# Altium schematic sheet MOTOR.SchDoc
size A3
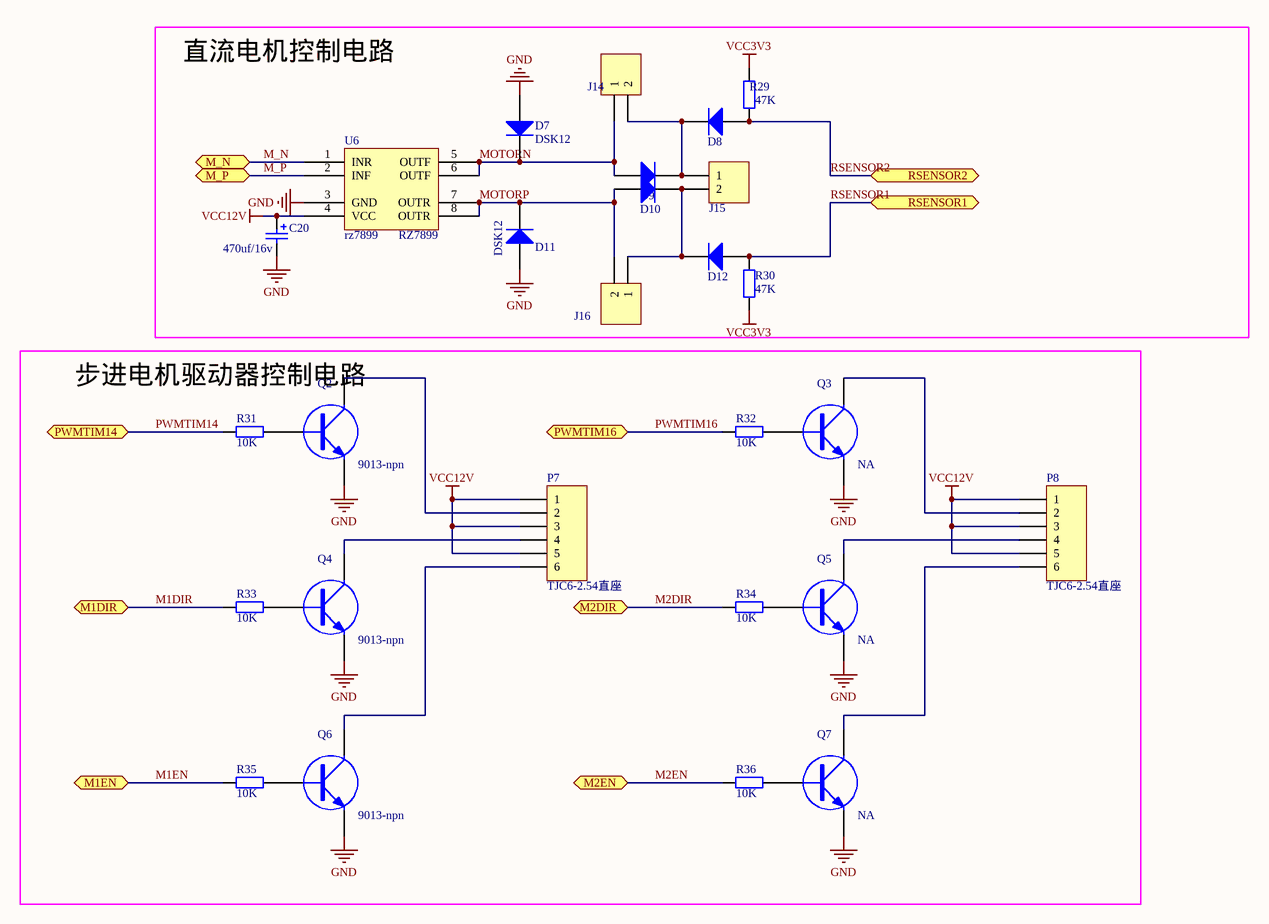
[diagram p0: MOTOR.SchDoc]

## Parts
C20  470uf/16v  [cap_470/16v]
D7  型号: DSK12  [SOD123_D]  (hidden comment: Diode_SOD523)
D8  Diode_SOD323  [SOD323_D]  (value not drawn)
D9  Diode_DO214AB  [SOD123-F]  (value not drawn)
D10  Diode_DO214AB  [SOD123-F]  (value not drawn)
D11  型号: DSK12  [SOD123_D]  (hidden comment: Diode_SOD523)
D12  Diode_SOD323  [SOD323_D]  (value not drawn)
J14  XHB2.54-2PIN-带锁扣  [SIP2]  (value not drawn)
J15  XHB2.54-2PIN-带锁扣  [SIP2]  (value not drawn)
J16  XHB2.54-2PIN-带锁扣  [SIP2]  (value not drawn)
P7  TJC6-2.54直座  [SIP6]
P8  TJC6-2.54直座  [SIP6]
Q2  型号: 9013-npn  [SOT23]  (hidden comment: NPN_SOT23)
Q3  型号: NA  [SOT23]  (hidden comment: NPN_SOT23)
Q4  型号: 9013-npn  [SOT23]  (hidden comment: NPN_SOT23)
Q5  型号: NA  [SOT23]  (hidden comment: NPN_SOT23)
Q6  型号: 9013-npn  [SOT23]  (hidden comment: NPN_SOT23)
Q7  型号: NA  [SOT23]  (hidden comment: NPN_SOT23)
R29  型号: 47K  [0603R]  (hidden comment: Res_0603)
R30  型号: 47K  [0603R]  (hidden comment: Res_0603)
R31  型号: 10K  [0603R]  (hidden comment: Res_0603)
R32  型号: 10K  [0603R]  (hidden comment: Res_0603)
R33  型号: 10K  [0603R]  (hidden comment: Res_0603)
R34  型号: 10K  [0603R]  (hidden comment: Res_0603)
R35  型号: 10K  [0603R]  (hidden comment: Res_0603)
R36  型号: 10K  [0603R]  (hidden comment: Res_0603)
U6  rz7899  [SOP_8]

## Blocks framed on the sheet
直流电机控制电路: C20 D7-D12 J14-J16 R29 R30 U6
步进电机驱动器控制电路: P7 P8 Q2-Q7 R31-R36

## Ports
M1DIR, M1EN, M2DIR, M2EN, M_N, M_P, PWMTIM14, PWMTIM16, RSENSOR1, RSENSOR2

## Nets
GND: C20.2 D7.1 D11.1 Q2.2(E) Q3.2(E) Q4.2(E) Q5.2(E) Q6.2(E) Q7.2(E) U6.3(GND)
VCC3V3: R29.2 R30.1
VCC12V: C20.1 P7.1 P7.3 P7.5 P8.1 P8.3 P8.5 U6.4(VCC)
M1DIR: R33.1 ; port M1DIR
M1EN: R35.1 ; port M1EN
M2DIR: R34.1 ; port M2DIR
M2EN: R36.1 ; port M2EN
M_N: U6.1(INR) ; port M_N
M_P: U6.2(INF) ; port M_P
MOTORN: D7.2 D9.1 J14.1 U6.5(OUTF) U6.6(OUTF)
MOTORP: D10.1 D11.2 J16.2 U6.7(OUTR) U6.8(OUTR)
PWMTIM14: R31.1 ; port PWMTIM14
PWMTIM16: R32.1 ; port PWMTIM16
RSENSOR1: D12.1 R30.2 ; port RSENSOR1
RSENSOR2: D8.1 R29.1 ; port RSENSOR2
NetD8_2: D8.2 D9.2 J14.2 J15.1
NetD10_2: D10.2 D12.2 J15.2 J16.1
NetP7_2: P7.2 Q2.3(C)
NetP7_4: P7.4 Q4.3(C)
NetP7_6: P7.6 Q6.3(C)
NetP8_2: P8.2 Q3.3(C)
NetP8_4: P8.4 Q5.3(C)
NetP8_6: P8.6 Q7.3(C)
NetQ2_1: Q2.1(B) R31.2
NetQ3_1: Q3.1(B) R32.2
NetQ4_1: Q4.1(B) R33.2
NetQ5_1: Q5.1(B) R34.2
NetQ6_1: Q6.1(B) R35.2
NetQ7_1: Q7.1(B) R36.2

## Library data of the parts
C20 = Cap_直插470uf/16v: Polarized Capacitor (Radial); 名称: 贴片电容; 容差: 20%; 型号: 470UF/16V电容; 参考网址: *
D7 D11 = Diode_SOD523: Default Diode; 名称: 贴片二极管; 容差: *
D8 D12 = Diode_SOD323: Default Diode; Published: 8-Jun-2000; LatestRevisionDate: 17-Jul-2002; LatestRevisionNote: Re-released for DXP Platform.; PackageVersion: Sep-1996; PackageReference: SMC; Publisher: Altium Limited; PackageDescription: DO-214-AB/SMC; 2 C-Bend Leads; Body 7.9 x 5.9 mm, inc. leads (LxW); Code_JEDEC: DO-214-AB
D9 D10 = Diode_DO214AB: Default Diode; Published: 8-Jun-2000; LatestRevisionDate: 17-Jul-2002; LatestRevisionNote: Re-released for DXP Platform.; PackageVersion: Sep-1996; PackageReference: SMC; Publisher: Altium Limited; PackageDescription: DO-214-AB/SMC; 2 C-Bend Leads; Body 7.9 x 5.9 mm, inc. leads (LxW); Code_JEDEC: DO-214-AB
J14-J16 = XHB2.54-2P直座: Header, 4-Pin; 名称: 插接件; 容差: *; 参考网址: *; 型号: XHB2.54-2PIN-带锁扣
P7 = TJC6-2.54直座: Header, 6-Pin; 名称: 插接件; 型号: XHB2.54-6PIN-直插锁扣座; 容差: *; 参考网址: https://item.taobao.com/item.htm?spm=a230r.1.14.16.ebb2eb2XgBFau&id=536742831564&ns=1&abbucket=6#detail
P8 = TJC6-2.54直座: Header, 6-Pin; 名称: 插接件; 型号: NA; 容差: *; 参考网址: *
Q2-Q7 = NPN_SOT23: NPN Bipolar Transistor; 名称: 集成电路; 容差: *; 参考网址: *
R29-R36 = Res_0603: Resistor; 名称: 贴片电阻; 容差: 5%; 参考网址: *
U6 = rz7899: 电机驱动芯片3-25V 5A; 名称: 集成芯片; 型号: RZ7899; 容差: *; 参考网址: *